# Altium schematic sheet USB.SchDoc
size A4
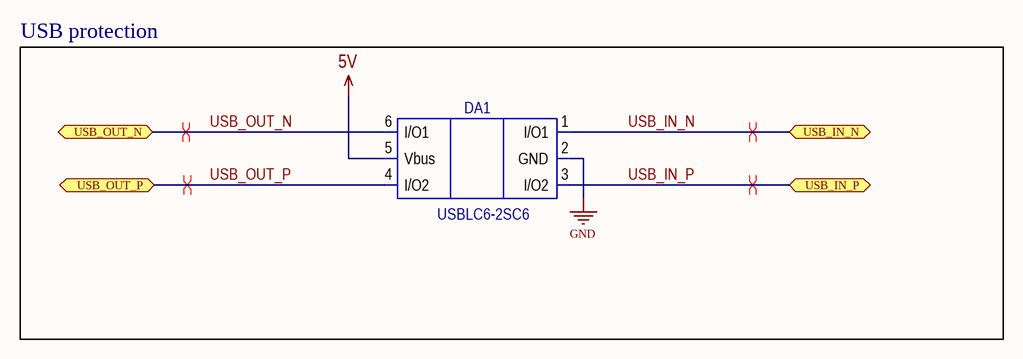
[diagram p0: USB.SchDoc]

## Parts
DA1  USBLC6-2SC6  [SOT-23-6]

## Blocks framed on the sheet
USB protection: DA1

## Ports
USB_IN_N (bidir), USB_IN_P (bidir), USB_OUT_N (bidir), USB_OUT_P (bidir)

## Nets
5V: DA1.5(Vbus)
GND: DA1.2(GND)
USB_IN_N: DA1.1(I/O1) ; port USB_IN_N
USB_IN_P: DA1.3(I/O2) ; port USB_IN_P
USB_OUT_N: DA1.6(I/O1) ; port USB_OUT_N
USB_OUT_P: DA1.4(I/O2) ; port USB_OUT_P

## Layout directives
differential pair: USB_IN_N, USB_IN_P, USB_OUT_N, USB_OUT_P

## Notes on the sheet
- Title
- Size:
- Date:
- A4
- Number:
- Time:
- Revision:
- Sheet
- of
- File:

## Library data of the parts
DA1 = USBLC6-2SC6: HelpURL: https://static.chipdip.ru/lib/093/DOC001093117.pdf